# EAGLE design circuit (EAGLE 6.6.0)
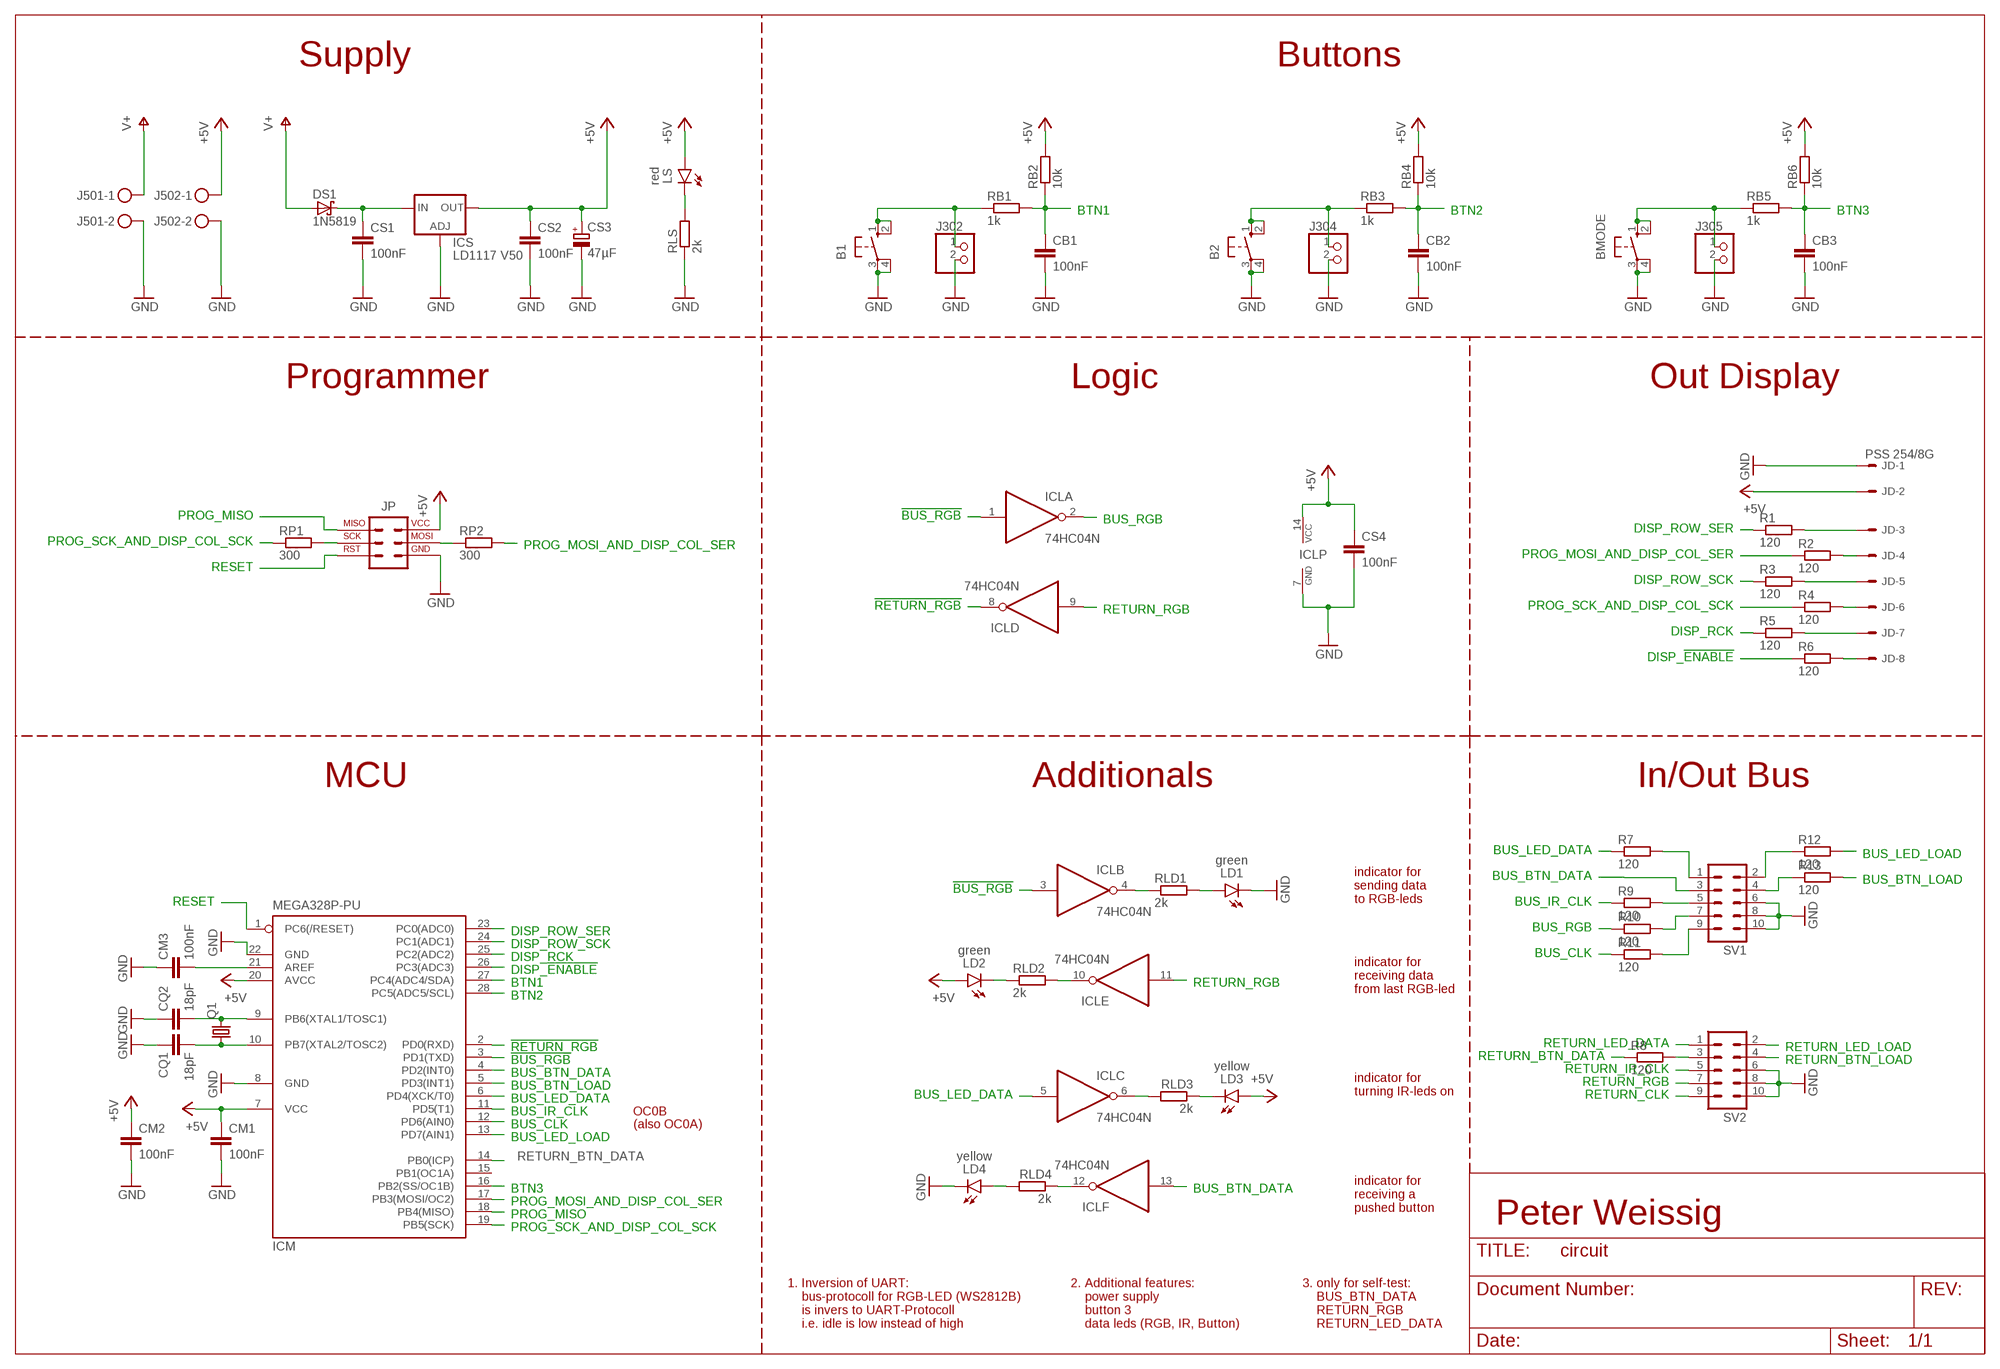
[diagram p0: schematic, sheet 1]

## Parts
B1  10-XX  [B3F-10XX]
B2  10-XX  [B3F-10XX]
BMODE  10-XX  [B3F-10XX]
CB1  100nF  C-EU025-025X050  [C025-025X050]
CB2  100nF  C-EU025-025X050  [C025-025X050]
CB3  100nF  C-EU025-025X050  [C025-025X050]
CM1  100nF  C-EU025-025X050  [C025-025X050]
CM2  100nF  C-EU025-025X050  [C025-025X050]
CM3  100nF  C-EU025-025X050  [C025-025X050]
CQ1  18pF  C-EU025-025X050  [C025-025X050]
CQ2  18pF  C-EU025-025X050  [C025-025X050]
CS1  100nF  C-EU025-025X050  [C025-025X050]
CS2  100nF  C-EU025-025X050  [C025-025X050]
CS3  47µF  CPOL-EUE2-5  [E2-5]
CS4  100nF  C-EU025-025X050  [C025-025X050]
DS1  1N5819  1N5819-B  [DO41-7.6]
ICL  74HC04N  74AC04N  [DIL14]
ICM  MEGA328P-PU  MEGA8-P  [DIL28-3]
ICS  LD1117 V50  LD117AV50  [TO220L1]
J302  PINHD-1X2  [1X02]
J304  PINHD-1X2  [1X02]
J305  PINHD-1X2  [1X02]
J501  STECKER_SPG_2  [STECKER_SPG_2]
J502  STECKER_SPG_2  [STECKER_SPG_2]
JD  PSS 254/8G  22-23-2081  [22-23-2081]
JP  STECKER_ISP_6  [STECKER_WANNE_6]
LD1  green  LED-3MM  [LED_3MM]
LD2  green  LED-3MM  [LED_3MM]
LD3  yellow  LED-3MM  [LED_3MM]
LD4  yellow  LED-3MM  [LED_3MM]
LS  red  LED-3MM  [LED_3MM]
Q1  CRYSTALHC49U70  [HC49U70]
R1  120  R-EU_R1206W  [R1206W]
R2  120  R-EU_R1206W  [R1206W]
R3  120  R-EU_R1206W  [R1206W]
R4  120  R-EU_R1206W  [R1206W]
R5  120  R-EU_R1206W  [R1206W]
R6  120  R-EU_R1206W  [R1206W]
R7  120  R-EU_R1206W  [R1206W]
R8  120  R-EU_R1206W  [R1206W]
R9  120  R-EU_R1206W  [R1206W]
R10  120  R-EU_R1206W  [R1206W]
R11  120  R-EU_R1206W  [R1206W]
R12  120  R-EU_R1206W  [R1206W]
R13  120  R-EU_R1206W  [R1206W]
RB1  1k  R-EU_0207/10  [0207/10]
RB2  10k  R-EU_0207/10  [0207/10]
RB3  1k  R-EU_0207/10  [0207/10]
RB4  10k  R-EU_0207/10  [0207/10]
RB5  1k  R-EU_0207/10  [0207/10]
RB6  10k  R-EU_0207/10  [0207/10]
RLD1  2k  R-EU_0207/10  [0207/10]
RLD2  2k  R-EU_0207/10  [0207/10]
RLD3  2k  R-EU_0207/10  [0207/10]
RLD4  2k  R-EU_0207/10  [0207/10]
RLS  2k  R-EU_0207/10  [0207/10]
RP1  300  R-EU_0207/10  [0207/10]
RP2  300  R-EU_0207/10  [0207/10]
SV1  ML10  [ML10]
SV2  ML10  [ML10]

## Nets
!BUS_RGB: ICL.1(A:I) ICL.3(B:I) ICM.3(PD1(TXD))
!RETURN_RGB: ICL.8(D:O) ICM.2(PD0(RXD))
+5V: CM1.1 CM2.1 CS2.1 CS3.+ CS4.1 ICL.14(P:VCC) ICM.7(VCC) ICM.20(AVCC) ICS.2(OUT) J502.1 JD.2 JP.2(2_VCC) LD2.A LD3.A LS.A RB2.2 RB4.2 RB6.2
BTN1: CB1.1 ICM.27(PC4(ADC4/SDA)) RB1.2 RB2.1
BTN2: CB2.1 ICM.28(PC5(ADC5/SCL)) RB3.2 RB4.1
BTN3: CB3.1 ICM.16(PB2(SS/OC1B)) RB5.2 RB6.1
BUS_BTN_DATA: ICL.13(F:I) ICM.4(PD2(INT0)) SV1.3
BUS_BTN_LOAD: ICM.5(PD3(INT1)) R13.2
BUS_CLK: ICM.12(PD6(AIN0)) R11.1
BUS_IR_CLK: ICM.11(PD5(T1)) R9.1
BUS_LED_DATA: ICL.5(C:I) ICM.6(PD4(XCK/T0)) R7.1
BUS_LED_LOAD: ICM.13(PD7(AIN1)) R12.2
BUS_RGB: ICL.2(A:O) R10.1
DISP_!ENABLE!: ICM.26(PC3(ADC3)) R6.1
DISP_RCK: ICM.25(PC2(ADC2)) R5.1
DISP_ROW_SCK: ICM.24(PC1(ADC1)) R3.1
DISP_ROW_SER: ICM.23(PC0(ADC0)) R1.1
GND: B1.3(P) B1.4(P1) B2.3(P) B2.4(P1) BMODE.3(P) BMODE.4(P1) CB1.2 CB2.2 CB3.2 CM1.2 CM2.2 CM3.1 CQ1.1 CQ2.1 CS1.2 CS2.2 CS3.- CS4.2 ICL.7(P:GND) ICM.8(GND) ICM.22(GND) ICS.1(ADJ) J302.2 J304.2 J305.2 J501.2 J502.2 JD.1 JP.6(6_GND) LD1.K(C) LD4.K(C) RLS.1 SV1.6 SV1.8 SV1.10 SV2.6 SV2.8 SV2.10
N$1: R7.2 SV1.1
N$2: R8.2 SV2.3
N$3: R9.2 SV1.5
N$4: B1.1(S) B1.2(S1) J302.1 RB1.1
N$5: CS1.1 DS1.C ICS.3(IN)
N$6: B2.1(S) B2.2(S1) J304.1 RB3.1
N$10: BMODE.1(S) BMODE.2(S1) J305.1 RB5.1
N$12: CQ1.2 ICM.10(PB7(XTAL2/TOSC2)) Q1.1
N$13: CQ2.2 ICM.9(PB6(XTAL1/TOSC1)) Q1.2
N$14: LS.K(C) RLS.2
N$15: CM3.2 ICM.21(AREF)
N$16: R10.2 SV1.7
N$17: R11.2 SV1.9
N$18: R13.1 SV1.4
N$19: R12.1 SV1.2
N$20: JD.3 R1.2
N$21: JD.4 R2.2
N$22: JD.5 R3.2
N$23: JD.6 R4.2
N$24: JD.7 R5.2
N$25: JD.8 R6.2
N$26: LD1.A RLD1.2
N$31: ICL.4(B:O) RLD1.1
N$32: ICL.10(E:O) RLD2.2
N$33: JP.3(3_SCK) RP1.2
N$34: LD2.K(C) RLD2.1
N$37: ICL.6(C:O) RLD3.2
N$38: LD3.K(C) RLD3.1
N$41: ICL.12(F:O) RLD4.1
N$42: LD4.A RLD4.2
PROG_MISO: ICM.18(PB4(MISO)) JP.1(1_MISO)
PROG_MOSI_1: JP.4(4_MOSI) RP2.1
PROG_MOSI_AND_DISP_COL_SER: ICM.17(PB3(MOSI/OC2)) R2.1 RP2.2
PROG_SCK_AND_DISP_COL_SCK: ICM.19(PB5(SCK)) R4.1 RP1.1
RESET: ICM.1(PC6(/RESET)) JP.5(5_RST)
RETURN_BTN_DATA: ICM.14(PB0(ICP)) R8.1
RETURN_BTN_LOAD: SV2.4
RETURN_CLK: SV2.9
RETURN_IR_CLK: SV2.5
RETURN_LED_DATA: SV2.1
RETURN_LED_LOAD: SV2.2
RETURN_RGB: ICL.9(D:I) ICL.11(E:I) SV2.7
V+: DS1.A J501.1
Unconnected: ICM.15(PB1(OC1A))

## Notes on the sheet
- Supply | Buttons
- Programmer | Logic | Out Display
- MCU | Additionals | In/Out Bus
- indicator for
  sending data
  to RGB-leds
- indicator for
  receiving data
  from last RGB-led
- indicator for
  turning IR-leds on
- OC0B
- (also OC0A)
- indicator for
  receiving a 
  pushed button
- Peter Weissig
- 1. Inversion of UART:
      bus-protocoll for RGB-LED (WS2812B)
      is invers to UART-Protocoll
      i.e. idle is low instead of high
- 2. Additional features:
      power supply
      button 3
      data leds (RGB, IR, Button)
- 3. only for self-test:
      BUS_BTN_DATA
      RETURN_RGB
      RETURN_LED_DATA

## Library data of the parts
B1 B2 BMODE = switch-omron:10-XX: OMRON SWITCH; MPN: B3F-1000; OC_FARNELL: 176432; OC_NEWARK: 36M3542
CB1-CB3 CM1-CM3 CQ1 CQ2 CS1 CS2 CS4 = rcl:C-EU: CAPACITOR, European symbol
CS3 = rcl:CPOL-EU: POLARIZED CAPACITOR, European symbol
DS1 = diode:1N581*: 1.0A SCHOTTKY BARRIER RECTIFIER Source: http://www.diodes.com/datasheets/ds23001.pdf
ICL = 74xx-eu:74*04: Hex INVERTER
ICM = atmel:MEGA8-P: MICROCONTROLLER 8 Kbytes FLASH, 1 kbytes SRAM, 512 bytes EEPROM, USART, 4-channel 10 bit ADC, 2-channel 8 bit ADC Pin compatible with Atmega48, ATMega88, ATMega168 Source: avr.lbr; OC_FARNELL: unknown; OC_NEWARK: unknown
ICS = v-reg:LD117A?*: Low drop fixed and adjustable positive voltage regulators 1 A Source: http://www.st.com/stonline/products/literature/ds/7194/ld1117axx.pdf
J302 J304 J305 = pinhead:PINHD-1X2: PIN HEADER
J501 J502 = robo_ag:STECKER_SPG_2: Anschlussklemme Reichelt:AKL 101-02 Nicht Anreihbar Reichelt:AKL 057-02 Anreihbar
JD = con-molex:22-23-2081: .100" (2.54mm) Center Header - 8 Pin; MF: MOLEX; MPN: 22-23-2081; OC_FARNELL: 1756826; OC_NEWARK: 01C7592
JP = robo_ag:STECKER_ISP_6: Wannenstecker Reichelt:WSL 6G 2x3 THT
LD1-LD4 LS = robo_ag:LED: Led Reichelt: LA E67B Variante: PLCC4 560-1400mcd 2,2V; 50mA Gelb-Orange SMD Reichelt: LA E67F Variante: PLCC4_REV 560mcd 2,65V; 50mA Orange SMD
Q1 = crystal:CRYSTAL: CRYSTAL; OC_FARNELL: unknown; OC_NEWARK: unknown
R1-R13 RB1-RB6 RLD1-RLD4 RLS RP1 RP2 = rcl:R-EU_: RESISTOR, European symbol
SV1 SV2 = con-harting-ml:ML10: HARTING; OC_FARNELL: unknown; OC_NEWARK: unknown

## Net classes
0 default: width 0.406 mm, drill 0.5 mm, clearance 0.254 mm

## Board
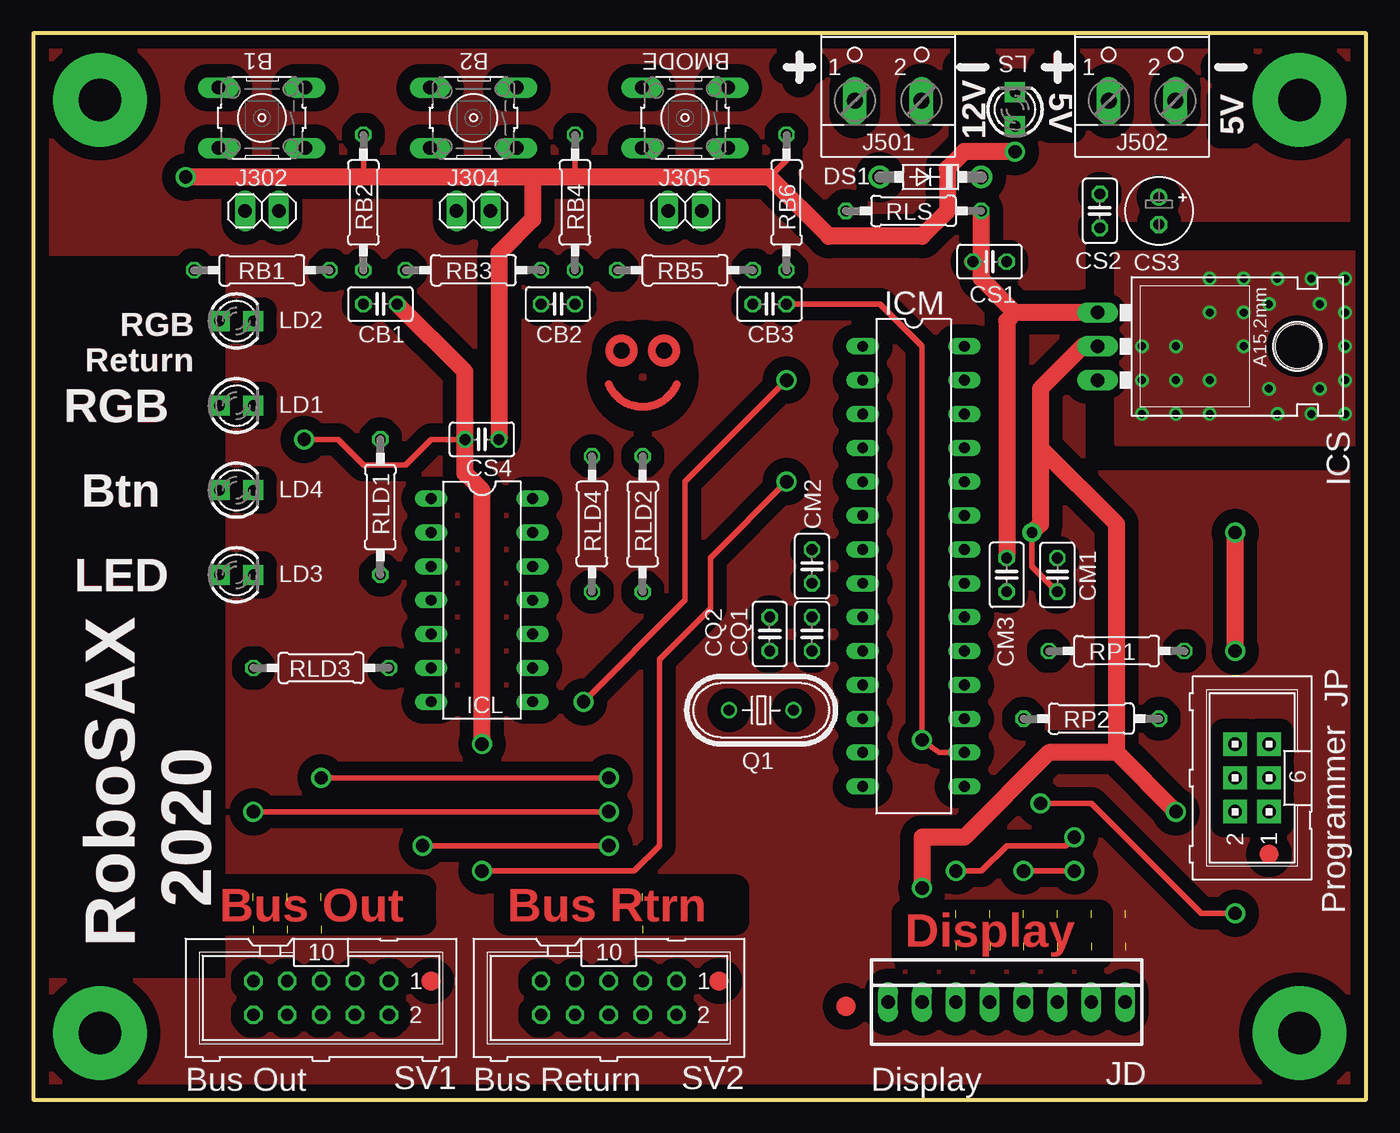
[diagram p1: board, top side]
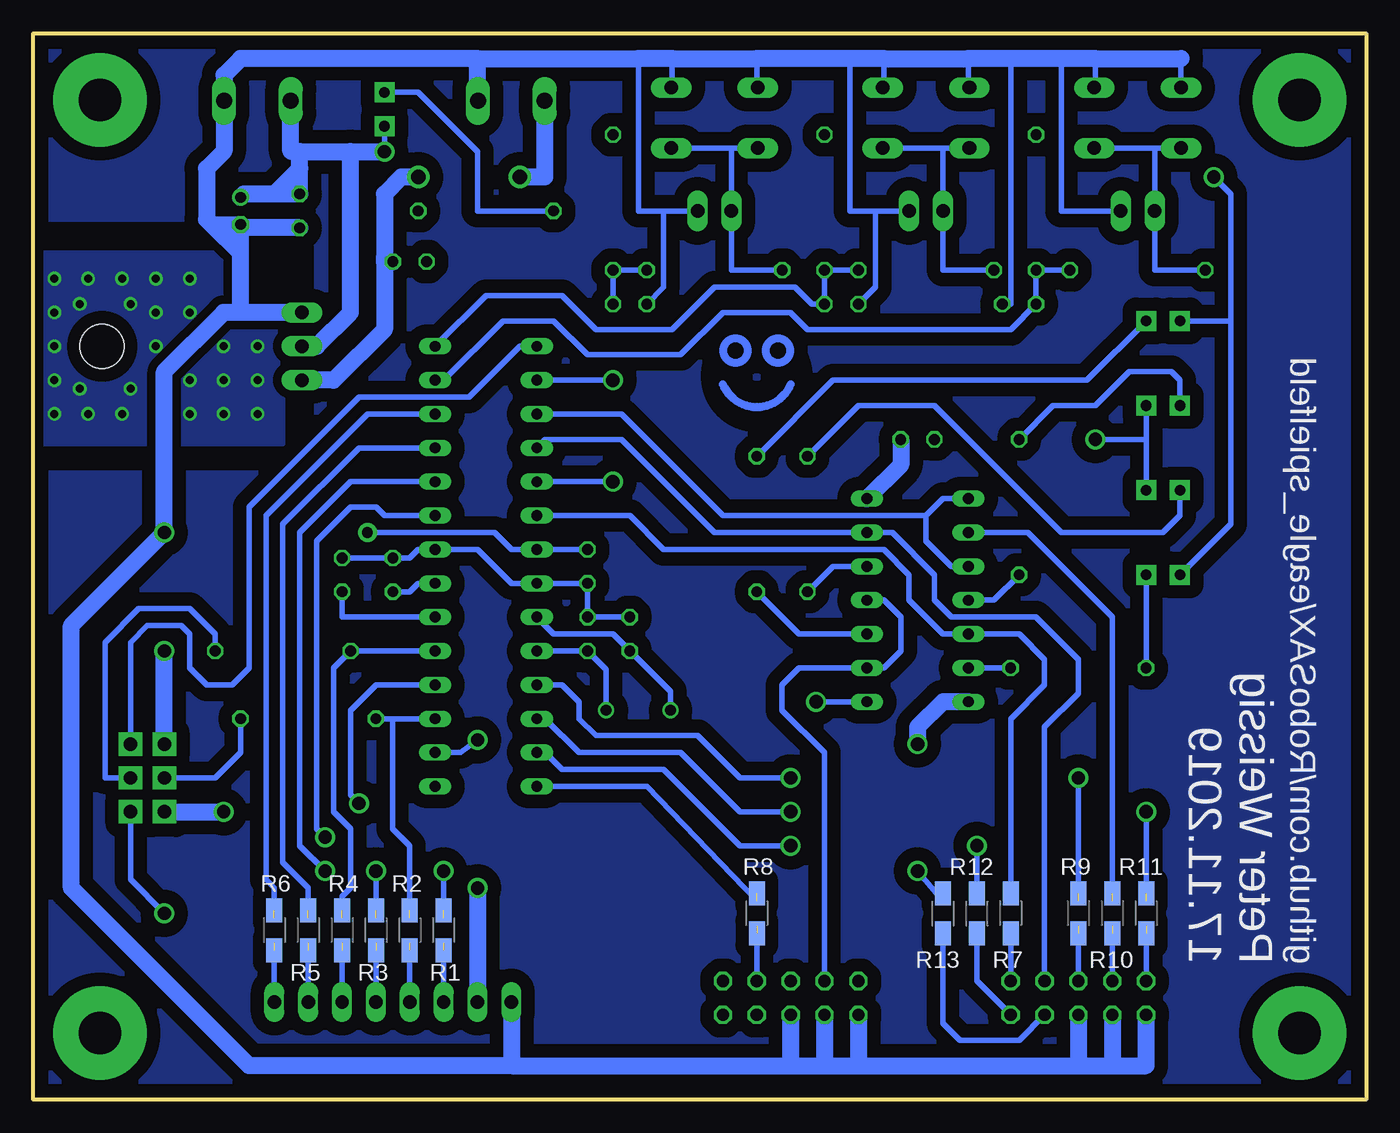
[diagram p2: board, bottom side, seen from below]

Size 100 x 80 mm. Coordinates in mm from the lower left corner, seen from the top.
Outline: 0,0 100,0 100,80 0,80 0,0
Copper layers (1*16): Top 0.035mm / dielectric 1.6mm / Bottom 0.035mm
Design rules "Elecrow_2-layer_PCB_eagle_rule": minimum track width 6mil, minimum drill 12mil, track to track 6mil, track to pad 6mil, pad to pad 6mil, via to via 8mil, smd to smd 0mil, copper to edge 20mil, drill to drill 10mil, minimum pad ring 6mil, minimum via ring 6mil, stop-mask expansion 0mil, vias tented up to drill 100mil, thermal gap 10mil
tRestrict: area 14,13.3 to 29.2,15.9; area 35.6,13.3 to 52.7,15.9; area 65.4,10.8 to 80,14; area 43.4,52 to 48,56.6
bRestrict: area 43.4,52 to 48,56.6

### Footprints (pad centres in the part's own frame; a part is rotated, then mirrored left to right if it is on the bottom)
B3F-10XX = drill 1.016 long: 1 -3.251,2.261; 2 3.251,2.261; 3 -3.251,-2.261; 4 3.251,-2.261
C025-025X050 = drill 0.813 octagon: 1 -1.27,0; 2 1.27,0
E2-5 = drill 0.813 pad 1.27: + -1.016,0 | drill 0.813 pad 1.27 octagon: - 1.016,0
DO41-7.6 = drill 1.1 pad 1.7: A 3.81,0; C -3.81,0
DIL14 = drill 0.813 long: 1 -7.62,-3.81; 2 -5.08,-3.81; 3 -2.54,-3.81; 4 0,-3.81; 5 2.54,-3.81; 6 5.08,-3.81; 7 7.62,-3.81; 8 7.62,3.81; 9 5.08,3.81; 10 2.54,3.81; 11 0,3.81; 12 -2.54,3.81; 13 -5.08,3.81; 14 -7.62,3.81
DIL28-3 = drill 0.813 long: 1 -16.51,-3.81; 2 -13.97,-3.81; 3 -11.43,-3.81; 4 -8.89,-3.81; 5 -6.35,-3.81; 6 -3.81,-3.81; 7 -1.27,-3.81; 8 1.27,-3.81; 9 3.81,-3.81; 10 6.35,-3.81; 11 8.89,-3.81; 12 11.43,-3.81; 13 13.97,-3.81; 14 16.51,-3.81; 15 16.51,3.81; 16 13.97,3.81; 17 11.43,3.81; 18 8.89,3.81; 19 6.35,3.81; 20 3.81,3.81; 21 1.27,3.81; 22 -1.27,3.81; 23 -3.81,3.81; 24 -6.35,3.81; 25 -8.89,3.81; 26 -11.43,3.81; 27 -13.97,3.81; 28 -16.51,3.81
TO220L1 = drill 1.016 long: 1 -2.54,-3.81; 2 0,-3.81; 3 2.54,-3.81 | hole 3.302: 0,11.176
1X02 = drill 1.016 long: 1 -1.27,0; 2 1.27,0
STECKER_SPG_2 = drill 1.194 long: 1 -2.5,-1.27; 2 2.5,-1.27
22-23-2081 = drill 1 long: 1 -8.89,0; 2 -6.35,0; 3 -3.81,0; 4 -1.27,0; 5 1.27,0; 6 3.81,0; 7 6.35,0; 8 8.89,0
STECKER_WANNE_6 = drill 1 pad 1.75 square: 1 -2.54,-1.27; 2 -2.54,1.27; 3 0,-1.27; 4 0,1.27; 5 2.54,-1.27; 6 2.54,1.27
LED_3MM = drill 0.8 pad 1.5 square: A -1.27,0; K 1.27,0
HC49U70 = drill 0.813: 1 -2.413,0; 2 2.413,0
R1206W = smd 1.8 x 1.2: 1 -1.499,0; 2 1.499,0
0207/10 = drill 0.813 octagon: 1 -5.08,0; 2 5.08,0
ML10 = drill 0.914 octagon: 1 -5.08,-1.27; 2 -5.08,1.27; 3 -2.54,-1.27; 4 -2.54,1.27; 5 0,-1.27; 6 0,1.27; 7 2.54,-1.27; 8 2.54,1.27; 9 5.08,-1.27; 10 5.08,1.27

### Placement (x,y rotation side)
B1  17.14,73.66 180 top
B2  33.02,73.66 180 top
BMODE  48.9,73.66 180 top
CB1  26.04,59.69 0 top
CB2  39.37,59.69 180 top
CB3  55.24,59.69 180 top
CM1  76.83,39.37 90 top
CM2  58.42,40.01 270 top
CM3  73.03,39.37 270 top
CQ1  58.42,34.92 270 top
CQ2  55.24,34.92 270 top
CS1  71.75,62.87 180 top
CS2  80.01,66.67 270 top
CS3  84.45,66.67 270 top
CS4  33.66,49.53 180 top
DS1  67.31,69.22 180 top
ICL  33.66,37.47 270 top
ICM  66.04,40.01 270 top
ICS  83.66,56.52 270 top
J302  17.14,66.67 0 top
J304  33.02,66.67 0 top
J305  48.9,66.67 0 top
J501  64.14,76.2 0 top
J502  83.19,76.2 0 top
JD  73.03,7.3 0 top
JP  91.44,24.13 90 top
LD1  15.24,52.07 0 top
LD2  15.24,58.42 0 top
LD3  15.24,39.37 0 top
LD4  15.24,45.72 0 top
LS  73.66,74.3 90 top
Q1  54.61,29.21 180 top
R1  69.22,12.7 270 bottom
R2  71.75,12.7 270 bottom
R3  74.3,12.7 270 bottom
R4  76.83,12.7 270 bottom
R5  79.38,12.7 270 bottom
R6  81.92,12.7 270 bottom
R7  26.67,13.97 270 bottom
R8  45.72,13.97 270 bottom
R9  21.59,13.97 270 bottom
R10  19.05,13.97 270 bottom
R11  16.51,13.97 270 bottom
R12  29.21,13.97 90 bottom
R13  31.75,13.97 90 bottom
RB1  17.14,62.23 0 top
RB2  24.77,67.31 90 top
RB3  33.02,62.23 0 top
RB4  40.64,67.31 90 top
RB5  48.9,62.23 0 top
RB6  56.52,67.31 90 top
RLD1  26.04,44.45 90 top
RLD2  45.72,43.18 270 top
RLD3  21.59,32.38 0 top
RLD4  41.91,43.18 90 top
RLS  66.04,66.67 180 top
RP1  81.28,33.66 0 top
RP2  79.38,28.57 180 top
SV1  21.59,7.62 180 top
SV2  43.18,7.62 180 top

### Tracks (layer width: path | path; a pad name or v marks a point on that pad's centre or on a via)
!BUS_RGB
  Bottom 0.406: 33.02,43.81 33.02,41.91 31.11,40.01 ICL.3 | ICL.1 31.75,45.09 33.02,43.81 | 33.02,43.81 48.26,43.81 55.88,51.44 ICM.3
!RETURN_RGB  (via drill 1)
  Top 0.406: v41.27,29.84 48.9,37.47 48.9,46.35 v56.52,53.98
  Bottom 0.406: ICM.2 v56.52,53.98 | v41.27,29.84 ICL.8
+5V  (via drill 0.8 pad 1.42, 1, 1 pad 1.27)
  Top 0.406: v74.93,42.55 74.93,40.01 CM1.1 | 24.77,69.22 RB2.2 | RB4.2 40.64,69.22 | RB6.2 56.52,70.48 55.24,69.22
  Top 1.27: 75.56,48.9 75.56,53.34 78.74,56.52 ICS.2 | 75.56,48.9 75.56,43.18 v74.93,42.55 | 81.28,26.04 81.28,43.18 75.56,48.9 | v85.72,21.59 81.28,26.04 | 81.28,26.04 76.2,26.04 69.85,19.68 66.67,19.68 v66.67,15.88 | v73.66,71.12 69.85,71.12 68.58,69.85 68.58,66.67 66.67,64.77 59.69,64.77 55.24,69.22 40.64,69.22 37.47,69.22 | 37.47,69.22 24.77,69.22 v11.43,69.22 | 37.47,69.22 37.47,66.04 34.92,63.5 CS4.1
  Bottom 0.406: CM2.1 ICM.7 64.14,41.27 65.41,42.55 v74.93,42.55 | ICM.20 76.83,36.2 CM1.1 | LD3.A 10.16,43.18 10.16,58.42 | 10.16,58.42 LD2.A | v73.66,71.12 LS.A | v11.43,69.22 10.16,67.94 10.16,58.42
  Bottom 1.27: 80.01,71.12 76.2,71.12 | 76.2,71.12 v73.66,71.12 | ICS.2 78.74,56.52 76.2,59.05 76.2,71.12 | 80.01,69.85 CS2.1 81.92,67.94 | 80.01,69.85 80.01,71.12 | 81.92,67.94 84.2,67.94 CS3.+ | JP.2 v85.72,21.59 | v66.67,15.88 JD.2 | CS4.1 34.92,47.62 ICL.14 | 80.01,71.12 80.64,71.12 80.69,71.16 J502.1 | 80.01,69.85 81.92,67.94
BTN1
  Bottom 0.406: RB1.2 RB2.1 CB1.1 26.67,57.78 41.91,57.78 43.18,59.05 48.26,59.05 51.44,55.88 58.42,55.88 60.96,58.42 64.77,58.42 69.22,53.98 ICM.27
BTN2
  Bottom 0.406: RB3.2 RB4.1 CB2.1 41.59,59.69 42.86,60.96 48.9,60.96 52.07,57.78 57.78,57.78 60.33,60.33 66.04,60.33 ICM.28
BTN3  (via drill 1)
  Top 0.406: CB3.1 63.5,59.69 66.67,56.52 v66.67,26.99 67.94,26.04 ICM.16
  Bottom 0.406: RB5.2 RB6.1 CB3.1 | v66.67,26.99 67.94,26.04 ICM.16
BUS_BTN_DATA
  Bottom 0.406: ICM.4 61.59,49.53 55.88,49.53 48.9,42.55 ICL.13 35.56,42.55 32.38,39.37 32.38,37.47 31.11,36.2 24.77,36.2 21.59,33.02 21.59,30.48 24.13,27.94 SV1.3
BUS_BTN_LOAD  (via drill 1)
  Top 0.406: v33.66,17.14 45.09,17.14 46.99,19.05 46.99,33.02 50.8,36.83 50.8,40.64 v56.52,46.35
  Bottom 0.406: ICM.5 v56.52,46.35 | v33.66,17.14 32.07,15.24 R13.2
BUS_CLK  (via drill 1)  (1 unrouted)
  Top 0.406: v43.18,21.59 v16.51,21.59
  Bottom 0.406: ICM.12 61.59,28.57 59.05,26.04 51.44,26.04 46.99,21.59 v43.18,21.59 | v16.51,21.59 16.51,14.92
BUS_IR_CLK  (via drill 1)  (1 unrouted)
  Top 0.406: v21.59,24.13 v43.18,24.13
  Bottom 0.406: ICM.11 60.33,31.11 59.05,29.84 59.05,28.57 57.78,27.3 50.16,27.3 46.99,24.13 v43.18,24.13 | v21.59,24.13 21.59,14.92
BUS_LED_DATA
  Bottom 0.406: ICM.6 55.24,43.81 52.7,41.27 36.2,41.27 34.29,39.37 34.29,37.47 31.75,34.92 ICL.5 26.04,34.92 24.13,33.02 24.13,31.11 26.67,28.57 R7.1
BUS_LED_LOAD  (via drill 1)
  Top 0.406: v43.18,19.05 v29.21,19.05
  Bottom 0.406: ICM.13 61.59,26.04 60.33,24.77 52.7,24.77 46.99,19.05 v43.18,19.05 | v29.21,19.05 R12.2
BUS_RGB  (1 unrouted)
  Bottom 0.406: 19.05,14.92 19.05,36.2 25.4,42.55 ICL.2
DISP_!ENABLE!  (1 unrouted)
  Bottom 0.406: 81.92,13.65 81.92,15.88 82.55,16.51 82.55,43.81 74.93,51.44 ICM.26
DISP_RCK  (1 unrouted)
  Bottom 0.406: ICM.25 75.56,48.9 81.28,43.18 81.28,17.78 79.38,15.88 79.38,13.65
DISP_ROW_SCK  (via drill 1)  (1 unrouted)
  Top 0.406: v78.11,17.14 v74.3,17.14
  Bottom 0.406: v74.3,17.14 74.3,13.65 | ICM.24 76.2,46.35 80.01,42.55 80.01,19.05 v78.11,17.14
DISP_ROW_SER  (via drill 1)  (1 unrouted)
  Top 0.406: v69.22,17.14 71.12,17.14 73.03,19.05 77.47,19.05 v78.11,19.68
  Bottom 0.406: v69.22,17.14 69.22,13.65 | ICM.23 73.66,43.81 74.3,44.45 76.2,44.45 78.74,41.91 78.74,20.32 v78.11,19.68
GND  (via drill 1, 1 pad 1.27)
  Top 0.406: CS4.2 29.84,49.53 27.94,47.62 24.77,47.62 22.86,49.53 v20.32,49.53
  Top 1.27: ICS.1 73.66,59.05 | 73.66,59.05 71.12,61.59 71.12,62.87 | 73.66,59.05 73.03,58.42 CM3.1 | v90.17,33.66 v90.17,42.55 | v33.66,26.67 33.66,45.72 32.38,46.99 CS4.2 32.38,54.61 CB1.2 | 71.12,62.87 RLS.1 | CS1.2 71.12,62.87
  Bottom 0.406: 20.32,75.92 20.32,78.11 | 29.84,75.92 29.84,78.11 | 36.2,75.92 36.2,78.11 | 45.72,75.92 45.72,78.11 | 52.07,75.92 52.07,78.11 | J304.2 36.83,66.67 | 36.83,66.67 38.73,66.67 38.73,78.11 | J305.2 52.7,66.67 | 52.7,66.67 54.61,66.67 54.61,78.11 | CM1.2 CM3.1 71.75,40.64 71.12,41.27 ICM.22 66.67,41.27 64.14,38.73 ICM.8 CM2.2 CQ1.1 CQ2.1 | CB3.2 52.7,60.96 52.7,66.67 | CB2.2 36.83,60.96 36.83,66.67 | CB1.2 26.67,59.69 26.67,78.11 | J302.2 22.86,66.67 22.86,78.11 | LD1.K 16.51,49.53 | 13.89,78.11 B1.4 | LD4.K 16.51,49.53 | 16.51,49.53 v20.32,49.53
  Bottom 1.27: J501.2 66.67,74.93 66.67,78.11 | B1.3 20.32,75.92 | B2.4 29.84,75.92 | B2.3 36.2,75.92 | BMODE.4 45.72,75.92 | BMODE.3 52.07,75.92 | ICS.1 84.45,59.05 | 84.45,59.05 85.72,59.05 90.17,54.61 v90.17,42.55 97.16,35.56 97.16,15.88 83.82,2.54 64.14,2.54 | 84.45,59.05 84.45,63.5 | 84.45,63.5 CS3.- | CS2.2 84.2,65.41 CS3.- | 86.61,65.66 86.68,65.72 87,66.04 87,69.85 85.69,71.16 J502.2 85.69,76.88 84.45,78.11 66.67,78.11 | 86.61,65.66 CS3.- | JP.6 v90.17,33.66 | JD.1 64.14,2.54 | 64.14,2.54 43.18,2.54 | 43.18,2.54 40.64,2.54 | 40.64,2.54 38.1,2.54 | 38.1,2.54 21.59,2.54 | 21.59,2.54 19.05,2.54 | 19.05,2.54 16.51,2.54 SV1.10 | SV1.8 19.05,2.54 | SV1.6 21.59,2.54 | SV2.8 40.64,2.54 | SV2.6 43.18,2.54 | SV2.10 38.1,2.54 | ICL.7 31.75,29.84 33.66,27.94 v33.66,26.67 | 66.67,78.11 54.61,78.11 52.07,78.11 45.72,78.11 38.73,78.11 36.2,78.11 29.84,78.11 26.67,78.11 22.86,78.11 20.32,78.11 13.89,78.11 | 86.61,65.66 84.45,63.5
ICS_TAB  (via drill 0.6 pad 1.02)
  other vias: 88.27,61.59 90.81,61.59 93.34,61.59 95.89,61.59 98.42,61.59 98.42,59.05 96.52,59.69 90.81,59.05 88.27,59.05 93.34,51.44 95.89,51.44 98.42,51.44 98.42,53.98 98.42,56.52 83.19,56.52 85.72,56.52 85.72,53.98 83.19,53.98 83.19,51.44 85.72,51.44 88.27,51.44 88.27,53.98 90.81,56.52 92.71,59.69 92.71,53.34 96.52,53.34
  pour Top (isolate 0.635): 81.28,63.5 81.28,49.21 99.69,49.21 99.69,63.5
  pour Bottom (isolate 0.635): 99.69,49.21 99.69,63.5 81.28,63.5 81.28,49.21
N$1
  Bottom 0.406: R7.2 SV1.1
N$2  (1 unrouted)
  Bottom 0.406: 45.72,13.02 SV2.3
N$3  (1 unrouted)
  Bottom 0.406: 21.59,13.02 SV1.5
N$4
  Bottom 0.406: B1.1 15.88,71.4 | 15.88,71.4 B1.2 | 15.88,71.4 J302.1 15.88,62.23 RB1.1
N$5
  Bottom 1.27: DS1.C 72.39,69.22 73.66,67.94 73.66,63.18 73.66,62.87 | ICS.3 77.47,53.98 73.66,57.78 73.66,62.87 | CS1.1 73.66,62.87
N$6
  Bottom 0.406: B2.2 31.75,71.4 | 31.75,71.4 B2.1 | 31.75,71.4 J304.1 31.75,62.23 RB3.1
N$10
  Bottom 0.406: BMODE.2 47.62,71.4 | 47.62,71.4 BMODE.1 | 47.62,71.4 J305.1 47.62,62.23 RB5.1
N$12
  Bottom 0.406: ICM.10 CQ1.2 57.02,32.26 Q1.1
N$13
  Bottom 0.406: ICM.9 60.96,34.92 56.52,34.92 CQ2.2 52.2,30.61 Q1.2
N$14
  Bottom 0.406: RLS.2 66.67,66.67 66.67,71.12 71.12,75.56 LS.K
N$15
  Bottom 0.406: ICM.21 71.12,38.73 71.75,38.1 CM3.2
N$16  (1 unrouted)
  Bottom 0.406: 19.05,13.02 SV1.7
N$17  (1 unrouted)
  Bottom 0.406: 16.51,13.02 SV1.9
N$18
  Bottom 0.406: R13.1 31.75,5.71 30.48,4.45 26.04,4.45 SV1.4
N$19
  Bottom 0.406: R12.1 29.21,8.89 SV1.2
N$20  (1 unrouted)
  Bottom 0.406: 69.22,11.75 JD.3
N$21  (1 unrouted)
  Bottom 0.406: 71.75,11.75 JD.4
N$22  (1 unrouted)
  Bottom 0.406: 74.3,11.75 JD.5
N$23  (1 unrouted)
  Bottom 0.406: 76.83,11.75 JD.6
N$24  (1 unrouted)
  Bottom 0.406: 79.38,11.75 JD.7
N$25  (1 unrouted)
  Bottom 0.406: 81.92,11.75 JD.8
N$26
  Bottom 0.406: RLD1.2 23.5,52.07 20.32,52.07 17.78,54.61 14.61,54.61 13.97,53.98 LD1.A
N$27  (via drill 3.2 pad 7)
  other vias: 5,5
N$28  (via drill 3.2 pad 7)
  other vias: 95,5
N$29  (via drill 3.2 pad 7)
  other vias: 95,75
N$30  (via drill 3.2 pad 7)
  other vias: 5,75
N$31
  Bottom 0.406: ICL.4 27.94,37.47 RLD1.1
N$32
  Bottom 0.406: ICL.10 42.55,34.92 RLD2.2
N$33
  Bottom 0.406: JP.3 94.61,24.13 94.61,34.29 92.08,36.83 88.27,36.83 86.36,34.92 RP1.2
N$34
  Bottom 0.406: RLD2.1 40.01,53.98 20.95,53.98 LD2.K
N$35
  pour Bottom (isolate 1.016): 0,80.01 0,0 100.33,0 100.33,46.99 78.74,46.99 78.74,66.04 100.33,66.04 100.33,80.01
  pour Top (isolate 1.016): 100.33,80.01 100.33,66.04 78.74,66.04 78.74,46.99 100.33,46.99 100.33,0 0,0 0,8.89 14.61,8.89 14.61,63.5 0,63.5 0,80.01
N$36
  Top 0.61: 48.26,53.66 arc-135 43.18,53.66
N$37
  Bottom 0.406: RLD3.2 ICL.6
N$38
  Bottom 0.406: LD3.K RLD3.1
N$39
  Top 0.61: 75.88,77.47 76.83,77.47 | 76.83,77.47 77.79,77.47 | 76.83,77.47 76.83,78.42 | 76.83,77.47 76.83,76.52
N$40
  Bottom 0.61: 48.26,53.66 arc-135 43.18,53.66
N$41
  Bottom 0.406: ICL.12 40.01,40.01 RLD4.1
N$42
  Bottom 0.406: RLD4.2 38.1,52.07 32.38,52.07 22.86,42.55 15.24,42.55 13.97,43.81 LD4.A
N$44
  Top 0.61: 88.9,77.47 90.81,77.47
N$45
  Top 0.61: 69.53,77.47 71.44,77.47
N$46
  Top 0.61: 56.52,77.47 57.47,77.47 | 57.47,77.47 58.42,77.47 | 57.47,77.47 57.47,76.52 | 57.47,77.47 57.47,78.42
PROG_MISO  (via drill 1)
  Top 0.406: v90.17,13.97 87.63,13.97 79.38,22.23 v75.56,22.23
  Bottom 0.406: ICM.18 74.3,31.11 76.2,29.21 76.2,22.86 v75.56,22.23 | v90.17,13.97 92.71,16.51 JP.1
PROG_MOSI_1
  Bottom 0.406: RP2.1 84.45,26.04 86.36,24.13 JP.4
PROG_MOSI_AND_DISP_COL_SER  (1 unrouted)
  Bottom 0.406: RP2.2 73.03,28.57 | 73.03,28.57 ICM.17 | 71.75,13.65 71.75,19.05 73.03,20.32 73.03,28.57
PROG_SCK_AND_DISP_COL_SCK  (1 unrouted)
  Bottom 0.406: ICM.19 RP1.1 77.47,32.38 77.47,21.59 76.2,20.32 76.2,15.88 76.83,15.24 76.83,13.65
RESET
  Bottom 0.406: ICM.1 63.5,56.52 67.31,52.7 75.56,52.7 83.82,44.45 83.82,32.38 85.09,31.11 87,31.11 88.27,32.38 88.27,34.92 88.9,35.56 91.44,35.56 92.71,34.29 JP.5
RETURN_BTN_DATA  (1 unrouted)
  Bottom 0.406: 45.72,14.92 53.98,23.5 ICM.14
RETURN_RGB
  Bottom 0.406: ICL.11 36.2,37.47 34.92,36.2 34.92,33.66 36.2,32.38 ICL.9 42.55,32.38 43.81,31.11 43.81,29.21 40.64,26.04 SV2.7
V+
  Bottom 1.27: J501.1 61.63,69.22 DS1.A
(copper drawn outside any net)
  shapes: Bottom circle x2, Top circle x6

### Text on the board
Top: 5V | 12V | 5V | RGB / Return | RGB | Btn | LED | Bus Out | Bus Rtrn | RoboSAX / 2020 | Display
tNames: 5V | 12V | 5V | RGB / Return | RGB | Btn | LED | Programmer | RoboSAX / 2020 | Bus Out | Bus Return | Display
bNames: github.com/RoboSAX/eagle_spielfeld | Peter Weissig | 17.11.2019
tDocu: 20MHz